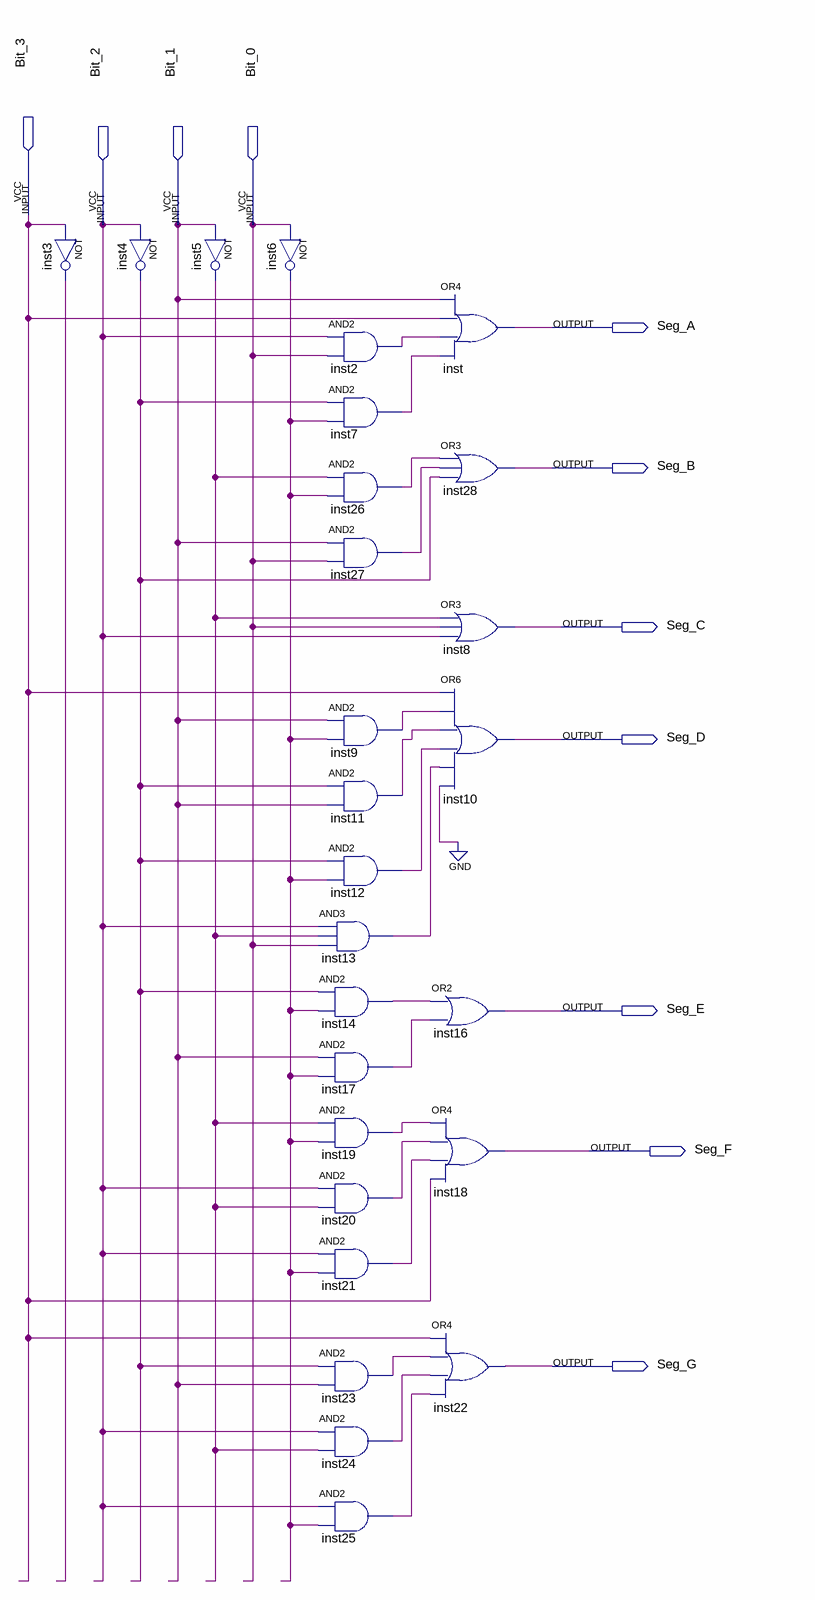
[diagram p0: schematic sheet]
// Quartus schematic decodificador.bdf as structural Verilog: 27 symbols, 11 pins
module decodificador (
  input  Bit_3,
  input  Bit_2,
  input  Bit_1,
  input  Bit_0,
  output Seg_A,
  output Seg_B,
  output Seg_C,
  output Seg_D,
  output Seg_E,
  output Seg_F,
  output Seg_G
);

  wire inst2_out, inst3_out, inst4_out, inst5_out, inst6_out, inst7_out, inst9_out, inst11_out, inst12_out,
       inst13_out, inst14_out, inst17_out, inst19_out, inst20_out, inst21_out, inst23_out, inst24_out,
       inst25_out, inst26_out, inst27_out;

  not inst3 (inst3_out, Bit_3);
  not inst4 (inst4_out, Bit_2);
  not inst5 (inst5_out, Bit_1);
  not inst6 (inst6_out, Bit_0);
  and inst2 (inst2_out, Bit_2, Bit_0);
  and inst7 (inst7_out, inst4_out, inst6_out);
  and inst26 (inst26_out, inst5_out, inst6_out);
  and inst27 (inst27_out, Bit_1, Bit_0);
  and inst9 (inst9_out, Bit_1, inst6_out);
  and inst11 (inst11_out, inst4_out, Bit_1);
  and inst12 (inst12_out, inst4_out, inst6_out);
  and inst13 (inst13_out, Bit_2, inst5_out, Bit_0);
  and inst14 (inst14_out, inst4_out, inst6_out);
  and inst17 (inst17_out, Bit_1, inst6_out);
  and inst19 (inst19_out, inst5_out, inst6_out);
  and inst20 (inst20_out, Bit_2, inst5_out);
  and inst21 (inst21_out, Bit_2, inst6_out);
  and inst23 (inst23_out, inst4_out, Bit_1);
  and inst24 (inst24_out, Bit_2, inst5_out);
  and inst25 (inst25_out, Bit_2, inst6_out);
  or inst (Seg_A, Bit_1, Bit_3, inst2_out, inst7_out);
  or inst28 (Seg_B, inst26_out, inst27_out, inst4_out);
  or inst8 (Seg_C, inst5_out, Bit_0, Bit_2);
  or inst10 (Seg_D, Bit_3, inst9_out, inst11_out, inst12_out, inst13_out, 1'b0);
  or inst16 (Seg_E, inst14_out, inst17_out);
  or inst18 (Seg_F, inst19_out, inst20_out, inst21_out, Bit_3);
  or inst22 (Seg_G, Bit_3, inst23_out, inst24_out, inst25_out);
endmodule
